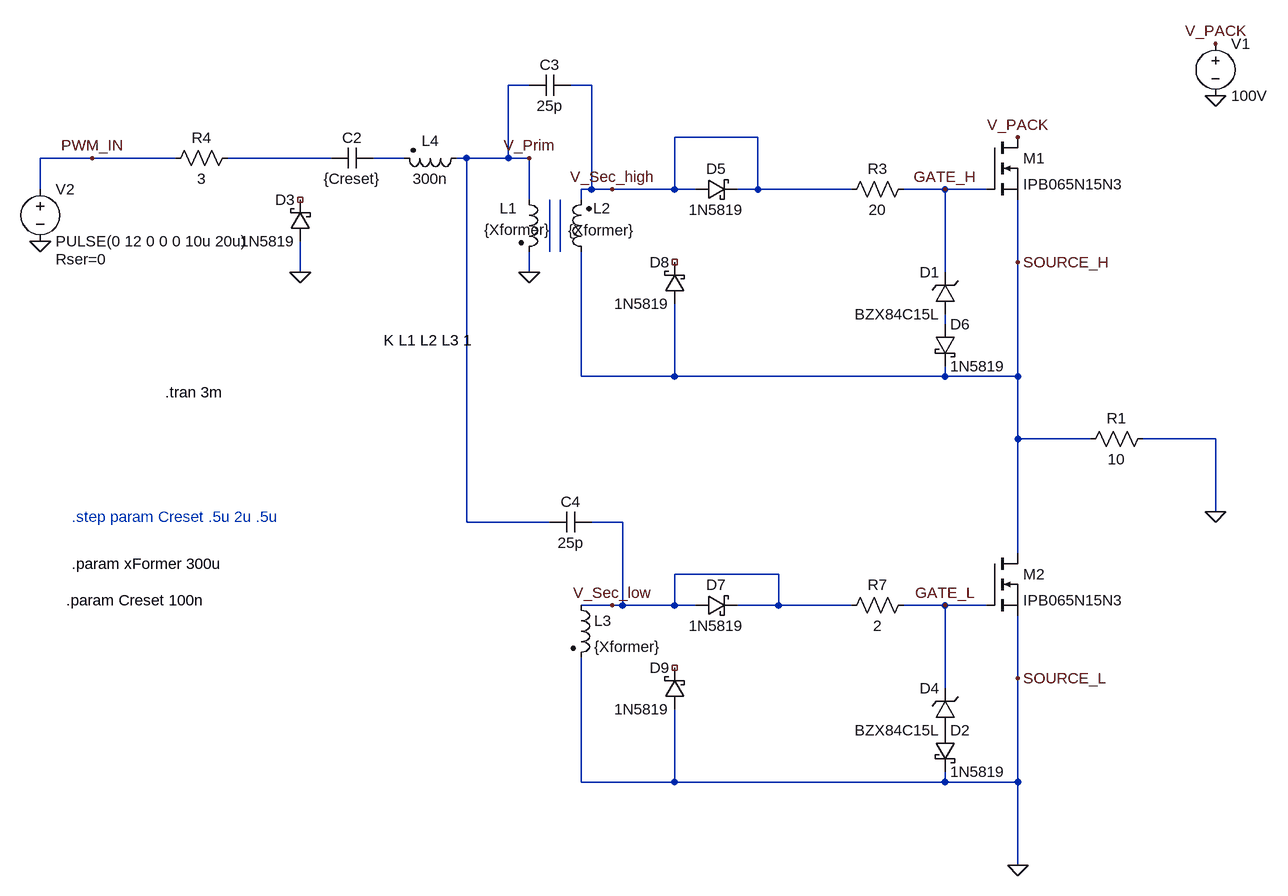
[diagram p0: schematic IsolatedGateDriver_simple.asc]
IsolatedGateDriver_simple.asc, the LTspice schematic file:
Version 4
SHEET 1 996 1044
WIRE -144 -176 -176 -176
WIRE -48 -176 -80 -176
WIRE 208 -96 80 -96
WIRE -816 -64 -896 -64
WIRE -688 -64 -816 -64
WIRE -448 -64 -608 -64
WIRE -336 -64 -384 -64
WIRE -240 -64 -256 -64
WIRE -176 -64 -176 -176
WIRE -176 -64 -240 -64
WIRE -144 -64 -176 -64
WIRE -896 -16 -896 -64
WIRE -48 -16 -48 -176
WIRE -48 -16 -64 -16
WIRE -16 -16 -48 -16
WIRE 80 -16 80 -96
WIRE 80 -16 -16 -16
WIRE 112 -16 80 -16
WIRE 208 -16 208 -96
WIRE 208 -16 176 -16
WIRE 352 -16 208 -16
WIRE 496 -16 432 -16
WIRE 560 -16 496 -16
WIRE -144 0 -144 -64
WIRE -64 0 -64 -16
WIRE -112 80 -112 0
WIRE -96 80 -96 0
WIRE 608 96 608 0
WIRE -496 112 -496 64
WIRE -144 112 -144 80
WIRE 496 112 496 -16
WIRE 496 192 496 176
WIRE -64 272 -64 80
WIRE 80 272 80 160
WIRE 80 272 -64 272
WIRE 496 272 496 256
WIRE 496 272 80 272
WIRE 608 272 608 96
WIRE 608 272 496 272
WIRE 608 368 608 272
WIRE 720 368 608 368
WIRE 912 368 800 368
WIRE 912 480 912 368
WIRE -240 496 -240 -64
WIRE -112 496 -240 496
WIRE 0 496 -48 496
WIRE 608 544 608 368
WIRE 240 576 80 576
WIRE -16 624 -64 624
WIRE 0 624 0 496
WIRE 0 624 -16 624
WIRE 80 624 80 576
WIRE 80 624 0 624
WIRE 112 624 80 624
WIRE 240 624 240 576
WIRE 240 624 176 624
WIRE 352 624 240 624
WIRE 496 624 432 624
WIRE 560 624 496 624
WIRE 608 736 608 640
WIRE 496 752 496 624
WIRE -64 896 -64 704
WIRE 80 896 80 784
WIRE 80 896 -64 896
WIRE 496 896 496 880
WIRE 496 896 80 896
WIRE 608 896 608 736
WIRE 608 896 496 896
WIRE 608 1024 608 896
FLAG -144 112 0
FLAG 912 -160 0
FLAG 912 -240 V_PACK
FLAG 608 -96 V_PACK
FLAG -896 64 0
FLAG -816 -64 PWM_IN
FLAG 496 -16 GATE_H
FLAG 608 96 SOURCE_H
FLAG -496 112 0
FLAG -144 -64 V_Prim
FLAG -16 -16 V_Sec_high
FLAG 608 1024 0
FLAG 496 624 GATE_L
FLAG 608 736 SOURCE_L
FLAG -16 624 V_Sec_low
FLAG 912 480 0
SYMBOL ind2 -160 -16 R0
WINDOW 0 -29 29 Left 2
WINDOW 3 -53 62 Left 2
SYMATTR InstName L1
SYMATTR Value {Xformer}
SYMATTR Type ind
SYMATTR SpiceLine Rser=1
SYMBOL ind2 -48 96 R180
WINDOW 0 -30 83 Left 2
WINDOW 3 -67 49 Left 2
SYMATTR InstName L2
SYMATTR Value {Xformer}
SYMATTR Type ind
SYMATTR SpiceLine Rser=1
SYMBOL res 816 352 R90
WINDOW 0 0 56 VBottom 2
WINDOW 3 32 56 VTop 2
SYMATTR InstName R1
SYMATTR Value 10
SYMBOL voltage 912 -256 R0
WINDOW 123 0 0 Left 2
WINDOW 39 0 0 Left 2
SYMATTR InstName V1
SYMATTR Value 100V
SYMBOL nmos 560 -96 R0
SYMATTR InstName M1
SYMATTR Value IPB065N15N3
SYMBOL zener 512 176 R180
WINDOW 0 24 64 Left 2
WINDOW 3 24 0 Left 2
SYMATTR InstName D1
SYMATTR Value BZX84C15L
SYMATTR Description Diode
SYMATTR Type diode
SYMBOL voltage -896 -32 R0
WINDOW 123 0 0 Left 2
WINDOW 39 24 124 Left 2
SYMATTR SpiceLine Rser=0
SYMATTR InstName V2
SYMATTR Value PULSE(0 12 0 0 0 10u 20u)
SYMBOL cap -384 -80 R90
WINDOW 0 0 32 VBottom 2
WINDOW 3 32 32 VTop 2
SYMATTR InstName C2
SYMATTR Value {Creset}
SYMBOL res 448 -32 R90
WINDOW 0 0 56 VBottom 2
WINDOW 3 32 56 VTop 2
SYMATTR InstName R3
SYMATTR Value 20
SYMBOL schottky -480 64 R180
WINDOW 0 24 64 Left 2
WINDOW 3 24 0 Left 2
SYMATTR InstName D3
SYMATTR Value 1N5819
SYMATTR Description Diode
SYMATTR Type diode
SYMBOL res -592 -80 R90
WINDOW 0 0 56 VBottom 2
WINDOW 3 32 56 VTop 2
SYMATTR InstName R4
SYMATTR Value 3
SYMBOL ind2 -240 -80 R90
WINDOW 0 5 56 VBottom 2
WINDOW 3 32 56 VTop 2
SYMATTR InstName L4
SYMATTR Value 300n
SYMATTR Type ind
SYMBOL ind2 -80 608 R0
SYMATTR InstName L3
SYMATTR Value {Xformer}
SYMATTR Type ind
SYMATTR SpiceLine Rser=1
SYMBOL nmos 560 544 R0
SYMATTR InstName M2
SYMATTR Value IPB065N15N3
SYMBOL zener 512 816 R180
WINDOW 0 24 64 Left 2
WINDOW 3 24 0 Left 2
SYMATTR InstName D4
SYMATTR Value BZX84C15L
SYMATTR Description Diode
SYMATTR Type diode
SYMBOL res 448 608 R90
WINDOW 0 0 56 VBottom 2
WINDOW 3 32 56 VTop 2
SYMATTR InstName R7
SYMATTR Value 2
SYMBOL cap -80 -192 R90
WINDOW 0 0 32 VBottom 2
WINDOW 3 32 32 VTop 2
SYMATTR InstName C3
SYMATTR Value 25p
SYMBOL cap -48 480 R90
WINDOW 0 0 32 VBottom 2
WINDOW 3 32 32 VTop 2
SYMATTR InstName C4
SYMATTR Value 25p
SYMBOL schottky 480 192 R0
SYMATTR InstName D6
SYMATTR Value 1N5819
SYMATTR Description Diode
SYMATTR Type diode
SYMBOL schottky 480 816 R0
SYMATTR InstName D2
SYMATTR Value 1N5819
SYMATTR Description Diode
SYMATTR Type diode
SYMBOL schottky 112 0 R270
WINDOW 0 32 32 VTop 2
WINDOW 3 0 32 VBottom 2
SYMATTR InstName D5
SYMATTR Value 1N5819
SYMATTR Description Diode
SYMATTR Type diode
SYMBOL schottky 112 640 R270
WINDOW 0 32 32 VTop 2
WINDOW 3 0 32 VBottom 2
SYMATTR InstName D7
SYMATTR Value 1N5819
SYMATTR Description Diode
SYMATTR Type diode
SYMBOL schottky 96 160 R180
WINDOW 0 24 64 Left 2
WINDOW 3 24 0 Left 2
SYMATTR InstName D8
SYMATTR Value 1N5819
SYMATTR Description Diode
SYMATTR Type diode
SYMBOL schottky 96 784 R180
WINDOW 0 24 64 Left 2
WINDOW 3 24 0 Left 2
SYMATTR InstName D9
SYMATTR Value 1N5819
SYMATTR Description Diode
SYMATTR Type diode
TEXT -704 296 Left 2 !.tran 3m
TEXT -368 216 Left 2 !K L1 L2 L3 1
TEXT -848 488 Left 2 ;.step param Creset .5u 2u .5u
TEXT -856 616 Left 2 !.param Creset 100n
TEXT -848 560 Left 2 !.param xFormer 300u

The netlist it stands for:
* IsolatedGateDriver_simple.asc
L1 V_Prim 0 {Xformer} Rser=1
L2 SOURCE_H V_Sec_high {Xformer} Rser=1
R1 0 SOURCE_H 10
V1 V_PACK 0 100V
M1 V_PACK GATE_H SOURCE_H SOURCE_H IPB065N15N3
D1 N005 GATE_H BZX84C15L
V2 PWM_IN 0 PULSE(0 12 0 0 0 10u 20u) Rser=0
C2 N002 N001 {Creset}
R3 GATE_H V_Sec_high 20
D3 0 NC_01 1N5819
R4 N001 PWM_IN 3
L4 V_Prim N002 300n
L3 V_Sec_low 0 {Xformer} Rser=1
M2 SOURCE_H GATE_L 0 0 IPB065N15N3
D4 P001 GATE_L BZX84C15L
R7 GATE_L V_Sec_low 2
C3 V_Sec_high V_Prim 25p
C4 V_Sec_low V_Prim 25p
D6 N005 SOURCE_H 1N5819
D2 P001 0 1N5819
D5 V_Sec_high V_Sec_high 1N5819
D7 V_Sec_low V_Sec_low 1N5819
D8 SOURCE_H NC_02 1N5819
D9 0 NC_03 1N5819
.model D D
.lib standard.dio
.model NMOS NMOS
.model PMOS PMOS
.lib standard.mos
.tran 3m
K L1 L2 L3 1
* .step param Creset .5u 2u .5u
.param Creset 100n
.param xFormer 300u
.backanno
.end